# Altium schematic sheet Reed Switches.SchDoc
size A4; SheetNumber: 2; SheetTotal: 4
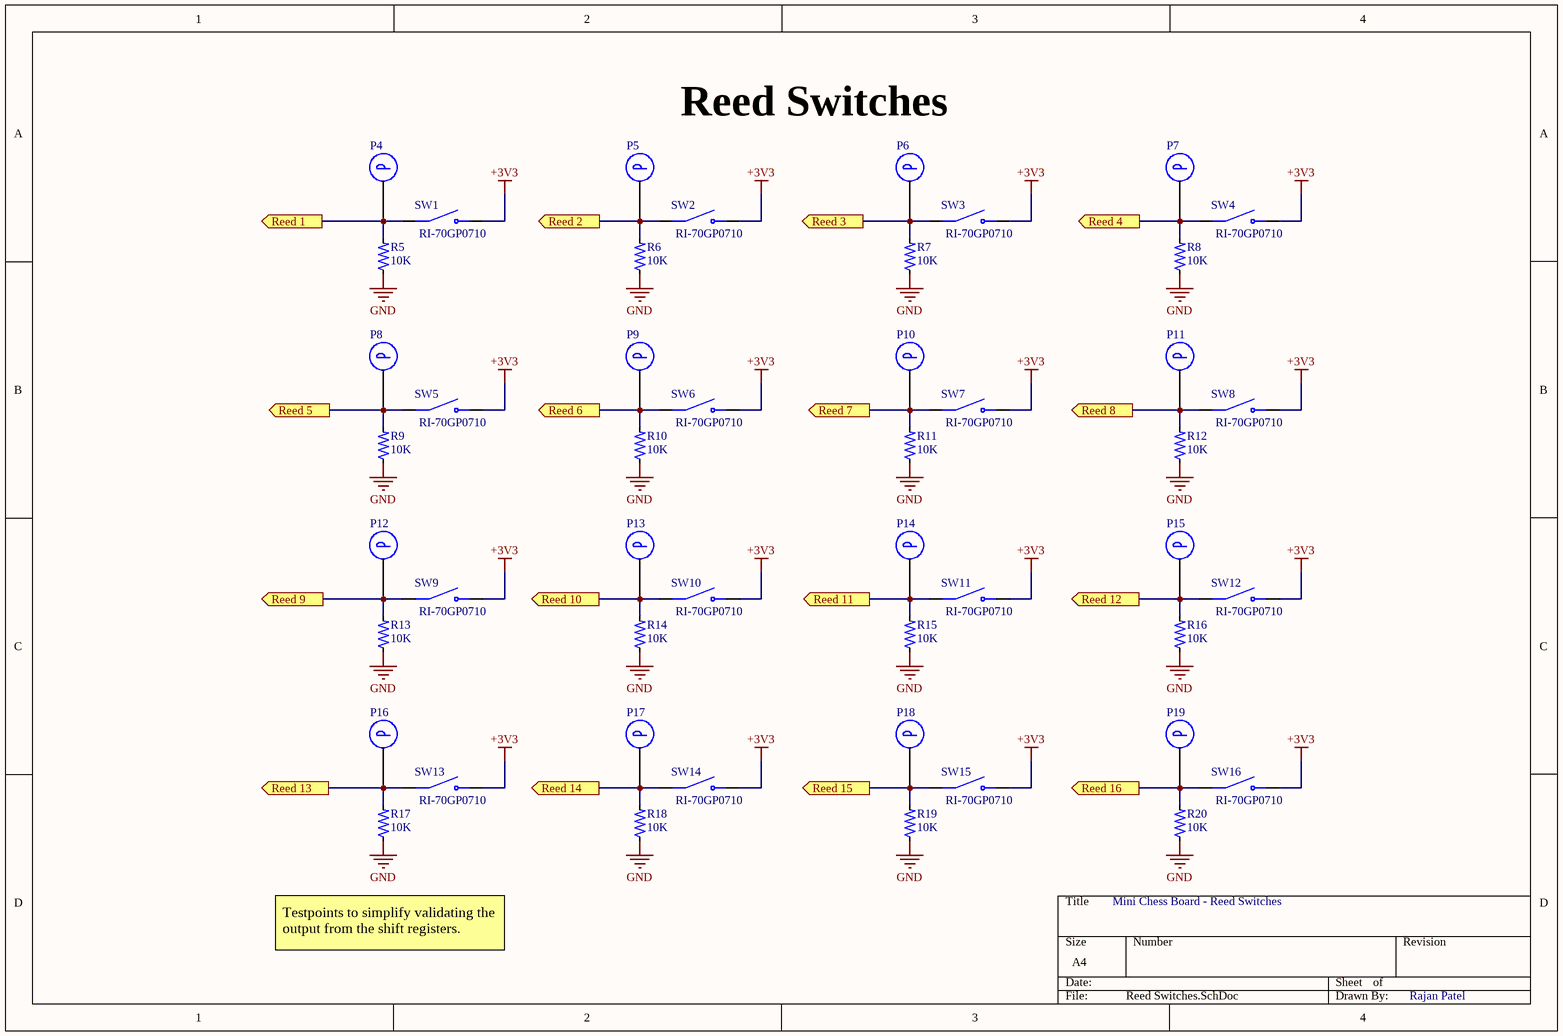
[diagram p0: Reed Switches.SchDoc]

## Parts
P4  Probe_5019  [Testpoint]  (value not drawn)
P5  Probe_5019  [Testpoint]  (value not drawn)
P6  Probe_5019  [Testpoint]  (value not drawn)
P7  Probe_5019  [Testpoint]  (value not drawn)
P8  Probe_5019  [Testpoint]  (value not drawn)
P9  Probe_5019  [Testpoint]  (value not drawn)
P10  Probe_5019  [Testpoint]  (value not drawn)
P11  Probe_5019  [Testpoint]  (value not drawn)
P12  Probe_5019  [Testpoint]  (value not drawn)
P13  Probe_5019  [Testpoint]  (value not drawn)
P14  Probe_5019  [Testpoint]  (value not drawn)
P15  Probe_5019  [Testpoint]  (value not drawn)
P16  Probe_5019  [Testpoint]  (value not drawn)
P17  Probe_5019  [Testpoint]  (value not drawn)
P18  Probe_5019  [Testpoint]  (value not drawn)
P19  Probe_5019  [Testpoint]  (value not drawn)
R5  10K  [res 0805]
R6  10K  [res 0805]
R7  10K  [res 0805]
R8  10K  [res 0805]
R9  10K  [res 0805]
R10  10K  [res 0805]
R11  10K  [res 0805]
R12  10K  [res 0805]
R13  10K  [res 0805]
R14  10K  [res 0805]
R15  10K  [res 0805]
R16  10K  [res 0805]
R17  10K  [res 0805]
R18  10K  [res 0805]
R19  10K  [res 0805]
R20  10K  [res 0805]
SW1  RI-70GP0710  [RI-70GP0710]
SW2  RI-70GP0710  [RI-70GP0710]
SW3  RI-70GP0710  [RI-70GP0710]
SW4  RI-70GP0710  [RI-70GP0710]
SW5  RI-70GP0710  [RI-70GP0710]
SW6  RI-70GP0710  [RI-70GP0710]
SW7  RI-70GP0710  [RI-70GP0710]
SW8  RI-70GP0710  [RI-70GP0710]
SW9  RI-70GP0710  [RI-70GP0710]
SW10  RI-70GP0710  [RI-70GP0710]
SW11  RI-70GP0710  [RI-70GP0710]
SW12  RI-70GP0710  [RI-70GP0710]
SW13  RI-70GP0710  [RI-70GP0710]
SW14  RI-70GP0710  [RI-70GP0710]
SW15  RI-70GP0710  [RI-70GP0710]
SW16  RI-70GP0710  [RI-70GP0710]

## Ports
Reed 1 (out, see Shift Registers[3C]), Reed 2 (out, see Shift Registers[3C]), Reed 3 (out, see Shift Registers[3C]), Reed 4 (out, see Shift Registers[3C]), Reed 5 (out, see Shift Registers[3B]), Reed 6 (out, see Shift Registers[3B]), Reed 7 (out, see Shift Registers[3B]), Reed 8 (out, see Shift Registers[3C]), Reed 9 (out, see Shift Registers[1C]), Reed 10 (out, see Shift Registers[1C]), Reed 11 (out, see Shift Registers[1C]), Reed 12 (out, see Shift Registers[1C]), Reed 13 (out, see Shift Registers[1B]), Reed 14 (out, see Shift Registers[1B]), Reed 15 (out, see Shift Registers[1B]), Reed 16 (out, see Shift Registers[1C])

## Nets
+3V3: SW1.2(NO) SW2.2(NO) SW3.2(NO) SW4.2(NO) SW5.2(NO) SW6.2(NO) SW7.2(NO) SW8.2(NO) SW9.2(NO) SW10.2(NO) SW11.2(NO) SW12.2(NO) SW13.2(NO) SW14.2(NO) SW15.2(NO) SW16.2(NO)
GND: R5.1 R6.1 R7.1 R8.1 R9.1 R10.1 R11.1 R12.1 R13.1 R14.1 R15.1 R16.1 R17.1 R18.1 R19.1 R20.1
Reed 1: P4.1 R5.2 SW1.1(COM) ; port Reed 1
Reed 2: P5.1 R6.2 SW2.1(COM) ; port Reed 2
Reed 3: P6.1 R7.2 SW3.1(COM) ; port Reed 3
Reed 4: P7.1 R8.2 SW4.1(COM) ; port Reed 4
Reed 5: P8.1 R9.2 SW5.1(COM) ; port Reed 5
Reed 6: P9.1 R10.2 SW6.1(COM) ; port Reed 6
Reed 7: P10.1 R11.2 SW7.1(COM) ; port Reed 7
Reed 8: P11.1 R12.2 SW8.1(COM) ; port Reed 8
Reed 9: P12.1 R13.2 SW9.1(COM) ; port Reed 9
Reed 10: P13.1 R14.2 SW10.1(COM) ; port Reed 10
Reed 11: P14.1 R15.2 SW11.1(COM) ; port Reed 11
Reed 12: P15.1 R16.2 SW12.1(COM) ; port Reed 12
Reed 13: P16.1 R17.2 SW13.1(COM) ; port Reed 13
Reed 14: P17.1 R18.2 SW14.1(COM) ; port Reed 14
Reed 15: P18.1 R19.2 SW15.1(COM) ; port Reed 15
Reed 16: P19.1 R20.2 SW16.1(COM) ; port Reed 16

## Notes on the sheet
- Reed Switches
- Mini Chess Board - Reed Switches
- Testpoints to simplify validating the output from the shift registers.
- Rajan Patel

## Library data of the parts
P4-P19 = Probe_5019: Phosphor Bronze Contact Miniature Silver Plated Surface Mount Test Points; Manufacturer: Keystone Electronics; Manufacturer Part Number: 5019; Supplier 1: Newark; RoHS: Yes; Category: Connectors; Stock 1: 148000; Pricing 1: 1=0.12300, 1000=0.12300, 2000=0.11700, 4000=0.11300, 6000=0.11000 (USD); Mount: Surface Mount,PCB; Number of Pins: 1; Contact Plating: Silver; Contact Material: Bronze; Material: Bronze; Plating: Silver; Body Material: Bronze; Packaging: Tape and Reel; Package Quantity: 1; Termination: SMD/SMT; Series: 5019; Height: 0.09inch; RoHS Compliant: Yes; Lead Free: Lead Free; Reach SVHC Compliant: Yes; ComponentLink1URL: https://datasheet.ciiva.com/16318/m60-2p61-16318395.pdf?src-supplier=Future+Electronics; ComponentLink1Description: https://datasheet.ciiva.com/16318/m60-2p61-16318395.pdf?src-supplier=Future+Electronics; ComponentLink2URL: https://datasheet.ciiva.com/16885/70182998-16885945.pdf?src-supplier=Allied+Electronics; ComponentLink2Description: https://datasheet.ciiva.com/16885/70182998-16885945.pdf?src-supplier=Allied+Electronics; ComponentLink3URL: https://datasheet.ciiva.com/14848/m60-2p61-14848437.pdf?src-supplier=Digi-Key; ComponentLink3Description: https://datasheet.ciiva.com/14848/m60-2p61-14848437.pdf?src-supplier=Digi-Key; ComponentLink4URL: https://datasheet.ciiva.com/14848/m60-2p61-14848438.pdf?src-supplier=Digi-Key; ComponentLink4Description: https://datasheet.ciiva.com/14848/m60-2p61-14848438.pdf?src-supplier=Digi-Key; ComponentLink5URL: https://datasheet.ciiva.com/14848/m60-2p61-14848439.pdf?src-supplier=Digi-Key; ComponentLink5Description: https://datasheet.ciiva.com/14848/m60-2p61-14848439.pdf?src-supplier=Digi-Key; Supplier Part Number 1: 06W4636
R5-R20 = Resistor 0805: MP: 2-2176053-2; Resistance: .39; Power_Rating: .25 W; MF: TE Connectivity; Tolerance: 1%; Package: 0805; Value: *; SnapEDA_Link: https://www.snapeda.com/parts/2-2176053-2/TE%20Connectivity/view-part/2214511/?ref=snap; Availability: Unavailable; Price: None; EU_RoHS_Compliance: Compliant with Exemptions
SW1-SW16 = RI-70GP0710: Switch Reed Spst-no 500MA 120V; Manufacturer: Comus; Supplier: Digikey; Supplier Part Number: 1835-1025-ND; Manufacturer Part Number: RI-70GP0710; RoHS: No; Stock: 52347; Pricing: 1=1.05, 10=1.01, 25=0.9496, 100=0.8201, 250=0.7474, 500=0.69488, 2000=0.6464, 4000=0.5858, 6000=0.5454 (USD); ComponentLink1URL: https://www.comus-intl.com/wp-content/uploads/2018/10/RI-70GP.pdf?src-supplier=Digikey; ComponentLink1Description: https://www.comus-intl.com/wp-content/uploads/2018/10/RI-70GP.pdf?src-supplier=Digikey